# Altium schematic sheet kd_inz_BL653.SchDoc
size A3; SheetNumber: 1; SheetTotal: 3
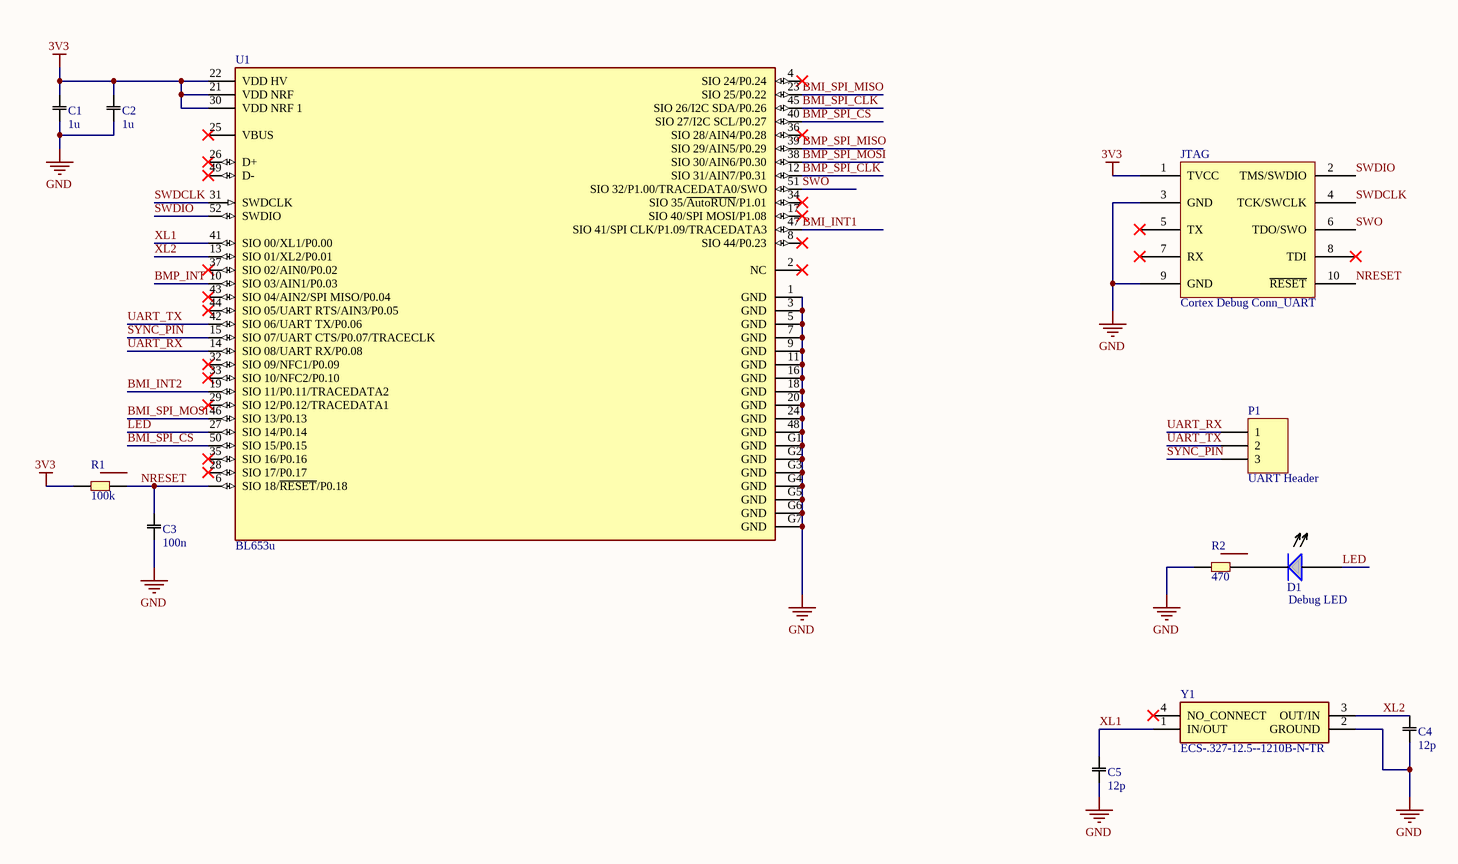
[diagram p0: kd_inz_BL653.SchDoc]

## Parts
C1  1u  [0402]
C2  1u  [0402]
C3  100n  [0402]
C4  12p  [0402]
C5  12p  [0402]
D1  Debug LED  [0402]
JTAG  Cortex Debug Conn_UART  [Cortex Debug Connector - THT]
P1  UART Header  [HDR1X3]
R1  100k  [0402]
R2  470  [0402]
U1  BL653u  [FP-453-00059R-MFG]
Y1  ECS-.327-12.5--1210B-N-TR  [ECS3271251210BNTR]

## Nets
3V3: C1.2 C2.2 JTAG.1(TVCC) R1.1 U1.21(VDD_NRF) U1.22(VDD_HV) U1.30(VDD_NRF_1)
GND: C1.1 C2.1 C3.1 C4.1 C5.1 JTAG.3(GND) JTAG.9(GND) R2.1 U1.1(GND) U1.3(GND) U1.5(GND) U1.7(GND) U1.9(GND) U1.11(GND) U1.16(GND) U1.18(GND) U1.20(GND) U1.24(GND) U1.48(GND) U1.G1(GND) U1.G2(GND) U1.G3(GND) U1.G4(GND) U1.G5(GND) U1.G6(GND) U1.G7(GND) Y1.2(GROUND)
BMI_INT1: U1.47(SIO_41/SPI_CLK/P1.09/TRACEDATA3)
BMI_INT2: U1.19(SIO_11/P0.11/TRACEDATA2)
BMI_SPI_CLK: U1.45(SIO_26/I2C_SDA/P0.26)
BMI_SPI_CS: U1.50(SIO_15/P0.15)
BMI_SPI_MISO: U1.23(SIO_25/P0.22)
BMI_SPI_MOSI: U1.46(SIO_13/P0.13)
BMP_INT: U1.10(SIO_03/AIN1/P0.03)
BMP_SPI_CLK: U1.12(SIO_31/AIN7/P0.31)
BMP_SPI_CS: U1.40(SIO_27/I2C_SCL/P0.27)
BMP_SPI_MISO: U1.39(SIO_29/AIN5/P0.29)
BMP_SPI_MOSI: U1.38(SIO_30/AIN6/P0.30)
LED: D1.2 U1.27(SIO_14/P0.14)
NRESET: C3.2 JTAG.10(~{RESET}) R1.2 U1.6(SIO_18/~{RESET}/P0.18)
SWDCLK: JTAG.4(TCK/SWCLK) U1.31(SWDCLK)
SWDIO: JTAG.2(TMS/SWDIO) U1.52(SWDIO)
SWO: JTAG.6(TDO/SWO) U1.51(SIO_32/P1.00/TRACEDATA0/SWO)
SYNC_PIN: P1.3 U1.15(SIO_07/UART_CTS/P0.07/TRACECLK)
UART_RX: P1.1 U1.14(SIO_08/UART_RX/P0.08)
UART_TX: P1.2 U1.42(SIO_06/UART_TX/P0.06)
XL1: C5.2 U1.41(SIO_00/XL1/P0.00) Y1.1(IN/OUT)
XL2: C4.2 U1.13(SIO_01/XL2/P0.01) Y1.3(OUT/IN)
NetD1_1: D1.1 R2.2

Not connected (* = marked no-connect by the designer): JTAG 5(TX)* 7(RX)* 8(TDI)*; U1 2(NC)* 4(SIO_24/P0.24)* 8(SIO_44/P0.23)* 17(SIO_40/SPI_MOSI/P1.08)* 25(VBUS)* 26(D+)* 28(SIO_17/P0.17)* 29(SIO_12/P0.12/TRACEDATA1)* 32(SIO_09/NFC1/P0.09)* 33(SIO_10/NFC2/P0.10)* 34(SIO_35/~{AutoRUN}/P1.01)* 35(SIO_16/P0.16)* 36(SIO_28/AIN4/P0.28)* 37(SIO_02/AIN0/P0.02)* 43(SIO_04/AIN2/SPI_MISO/P0.04)* 44(SIO_05/UART_RTS/AIN3/P0.05)* 49(D-)*; Y1 4(NO_CONNECT)*

## Library data of the parts
C1-C5 = C: Capacitor
D1 = LED
P1 = Header 3: Header, 3-Pin; LatestRevisionDate: 17-Jul-2002; LatestRevisionNote: Re-released for DXP Platform.; Publisher: Altium Limited
R1 R2 = R: Resistor
U1 = BL653u: BL653 MOD INTEGRATED ANT
Y1 = ECS-.327-12.5--1210B-N-TR: Crystal or Oscillator; Manufacturer_Name: ECS; Datasheet Link: https://4donline.ihs.com/images/VipMasterIC/IC/ECSI/ECSI-S-A0011101861/ECSI-S-A0011101861-1.pdf?hkey=EF798316E3902B6ED9A73243A3159BB0; Height: 0.35mm; Manufacturer_Part_Number: ECS-.327-12.5--1210B-N-TR